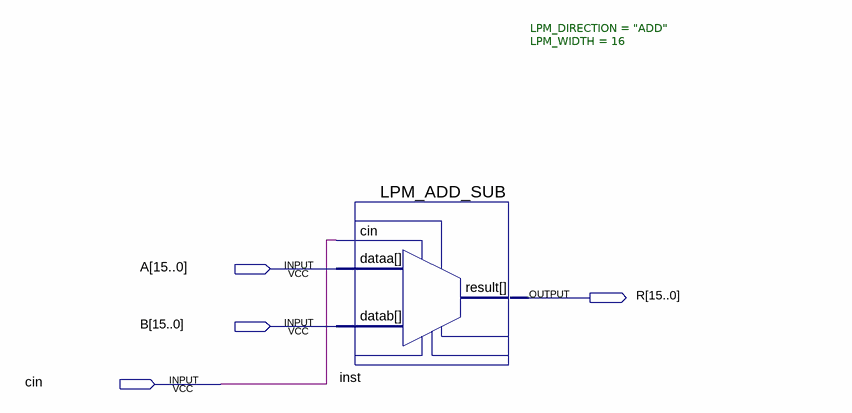
[diagram p0: schematic sheet]
// Quartus schematic Simple16add.bdf as structural Verilog: 1 symbols, 4 pins
module Simple16add (
  input  [15:0] A,
  input  [15:0] B,
  input  cin,
  output [15:0] R
);

  LPM_ADD_SUB #(.LPM_DIRECTION("ADD"), .LPM_WIDTH(16)) inst (.cin(cin), .dataa(A), .datab(B), .result(R));
endmodule
